# Altium schematic sheet RS485 UART Multiplexer.SchDoc: RS485 UART Multiplexer
size 292 x 193 mm; SheetNumber: 18; SheetTotal: 40
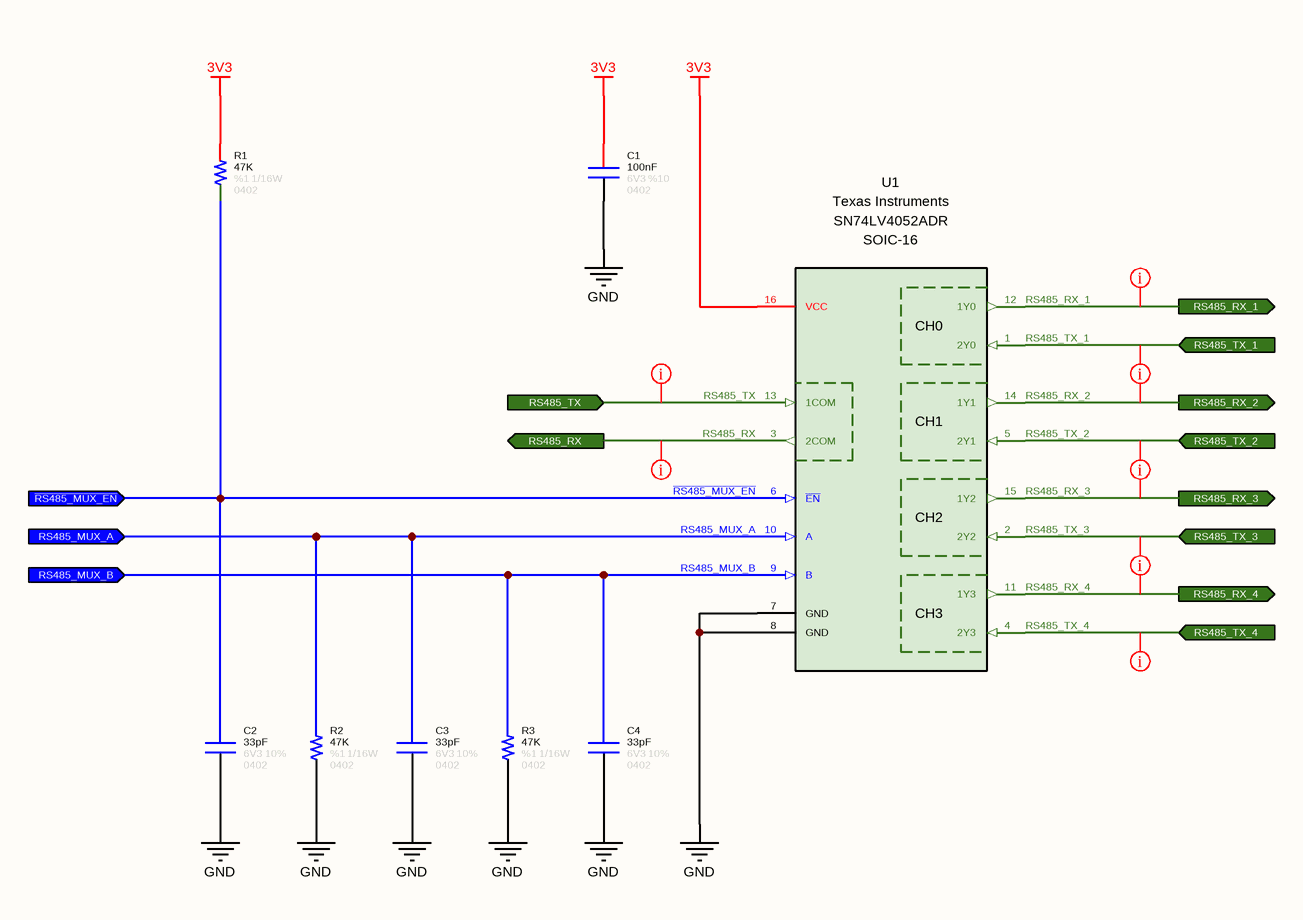
[diagram p0: RS485 UART Multiplexer.SchDoc]

## Parts
C1  value 100nF  Tolerance: %10  Voltage: 6V3  Case: 0402  [CAPACITOR_0402]  (hidden comment: Capacitor - 100nF [0402] (Ceramic))
C2  value 33pF  Tolerance: 10%  Case: 0402  Voltage: 6V3  [CAPACITOR_0402]  (hidden comment: Capacitor - 33pF [0402] (Ceramic))
C3  value 33pF  Tolerance: 10%  Case: 0402  Voltage: 6V3  [CAPACITOR_0402]  (hidden comment: Capacitor - 33pF [0402] (Ceramic))
C4  value 33pF  Tolerance: 10%  Case: 0402  Voltage: 6V3  [CAPACITOR_0402]  (hidden comment: Capacitor - 33pF [0402] (Ceramic))
R1  value 47K  Tolerance: %1  Case: 0402  Power: 1/16W  [RESISTOR_0402]  (hidden comment: 47K - 0402 - %1 - 1/16W)
R2  value 47K  Tolerance: %1  Case: 0402  Power: 1/16W  [RESISTOR_0402]  (hidden comment: 47K - 0402 - %1 - 1/16W)
R3  value 47K  Tolerance: %1  Case: 0402  Power: 1/16W  [RESISTOR_0402]  (hidden comment: 47K - 0402 - %1 - 1/16W)
U1  Manufacturer Name: Texas Instruments  Case: SOIC-16  [SOIC-16 Narrow]  (hidden comment: SN74LV4052ADR)

## Ports
RS485_MUX_A (in), RS485_MUX_B (in), RS485_RX (out), RS485_RX_1 (out), RS485_RX_2 (out), RS485_RX_3 (out), RS485_RX_4 (out), RS485_TX (in), RS485_TX_1 (in), RS485_TX_2 (in), RS485_TX_3 (in), RS485_TX_4 (in), ~{RS485_MUX_EN} (in)

## Nets
3V3: C1.2 R1.2 U1.16(VCC)
GND: C1.1 C2.1 C3.1 C4.1 R2.1 R3.1 U1.7(GND) U1.8(GND)
~{RS485_MUX_EN}: C2.2 R1.1 U1.6(~{EN}) ; port ~{RS485_MUX_EN}
RS485_MUX_A: C3.2 R2.2 U1.10(A) ; port RS485_MUX_A
RS485_MUX_B: C4.2 R3.2 U1.9(B) ; port RS485_MUX_B
RS485_RX: U1.3(2COM) ; port RS485_RX
RS485_RX_1: U1.12(1Y0) ; port RS485_RX_1
RS485_RX_2: U1.14(1Y1) ; port RS485_RX_2
RS485_RX_3: U1.15(1Y2) ; port RS485_RX_3
RS485_RX_4: U1.11(1Y3) ; port RS485_RX_4
RS485_TX: U1.13(1COM) ; port RS485_TX
RS485_TX_1: U1.1(2Y0) ; port RS485_TX_1
RS485_TX_2: U1.5(2Y1) ; port RS485_TX_2
RS485_TX_3: U1.2(2Y2) ; port RS485_TX_3
RS485_TX_4: U1.4(2Y3) ; port RS485_TX_4

## Layout directives
net class UART_Communication: RS485_RX, RS485_RX_1, RS485_RX_2, RS485_RX_3, RS485_RX_4, RS485_TX, RS485_TX_1, RS485_TX_2, RS485_TX_3, RS485_TX_4

## Notes on the sheet
- © 2021 All rights reserved.
  This document may not, in whole or in part, be copied, photocopied, reproduced, translated or converted to any electronic or machine readable from without prior written permission of Mehmet Günce Akkoyun.
  Engineer contact : akkoyun@me.com
- Property of
- Engineer :
- Date :
- Size :
- A4
- Time :
- Project :
- Page :
- /
- Customer :
- Product ID :
- Module ID :
- Version :
- File :
- Revision :
- (in symbol IC - SN74LV4052ADR) CH0; CH1; CH2; CH3

## Library data of the parts
C1 = Capacitor - 100nF [0402-6V3]: Capacitor - 100nF [0402-6V3] (Ceramic); Manufacturer Name: AVX; Manufacturer Part Number: 04026D104KAT4A; ComponentLink1Description: Mouser; ComponentLink1URL: https://www.mouser.com.tr/ProductDetail/AVX/04026D104KAT4A?qs=sGAEpiMZZMs0AnBnWHyRQPg4iYkCw7IMED%2F4kpqgf7w%3D; ComponentLink2Description: DataSheet; ComponentLink2URL: https://www.mouser.com.tr/datasheet/2/40/cx5r-776519.pdf
C2-C4 = Capacitor - 33pF [0402-6V3]: Manufacturer Name: Kemet; Manufacturer Part Number: C0402C330J9RACAUTO; ComponentLink1Description: DataSheet; ComponentLink1URL: https://api.kemet.com/component-edge/download/datasheet/C0402C330J9RACAUTO.pdf; ComponentLink2Description: Mouser; ComponentLink2URL: https://www.mouser.com/Search/Refine.aspx?Keyword=80-C0402C330J9RAUTO
R1-R3 = Resistor - 47K [0402]: Thick Film Resistors - SMD 1/16 W 47 KOhm 1%; Manufacturer Name: Vishay; Manufacturer Part Number: CRCW040247K0FKED; ComponentLink1Description: DataSheet; ComponentLink1URL: https://www.mouser.com.tr/datasheet/2/427/dcrcwe3-1762152.pdf; ComponentLink2Description: Mouser; ComponentLink2URL: https://www.mouser.com.tr/ProductDetail/Vishay-Dale/CRCW040247K0FKED?qs=sGAEpiMZZMu61qfTUdNhG2DpbjADlD3GL%252B3h1elTxqU%3D
U1 = IC - SN74LV4052ADR: Multiplexer Switch ICs Dual 4-Ch Analog Mltplxr/Demltplxr; Channel: 4; Maximum Operating Temperature: + 85 C; Minimum Operating Temperature: - 40 C; Product Type: Multiplexer Switch ICs; Manufacturer Part Number: SN74LV4052ADR